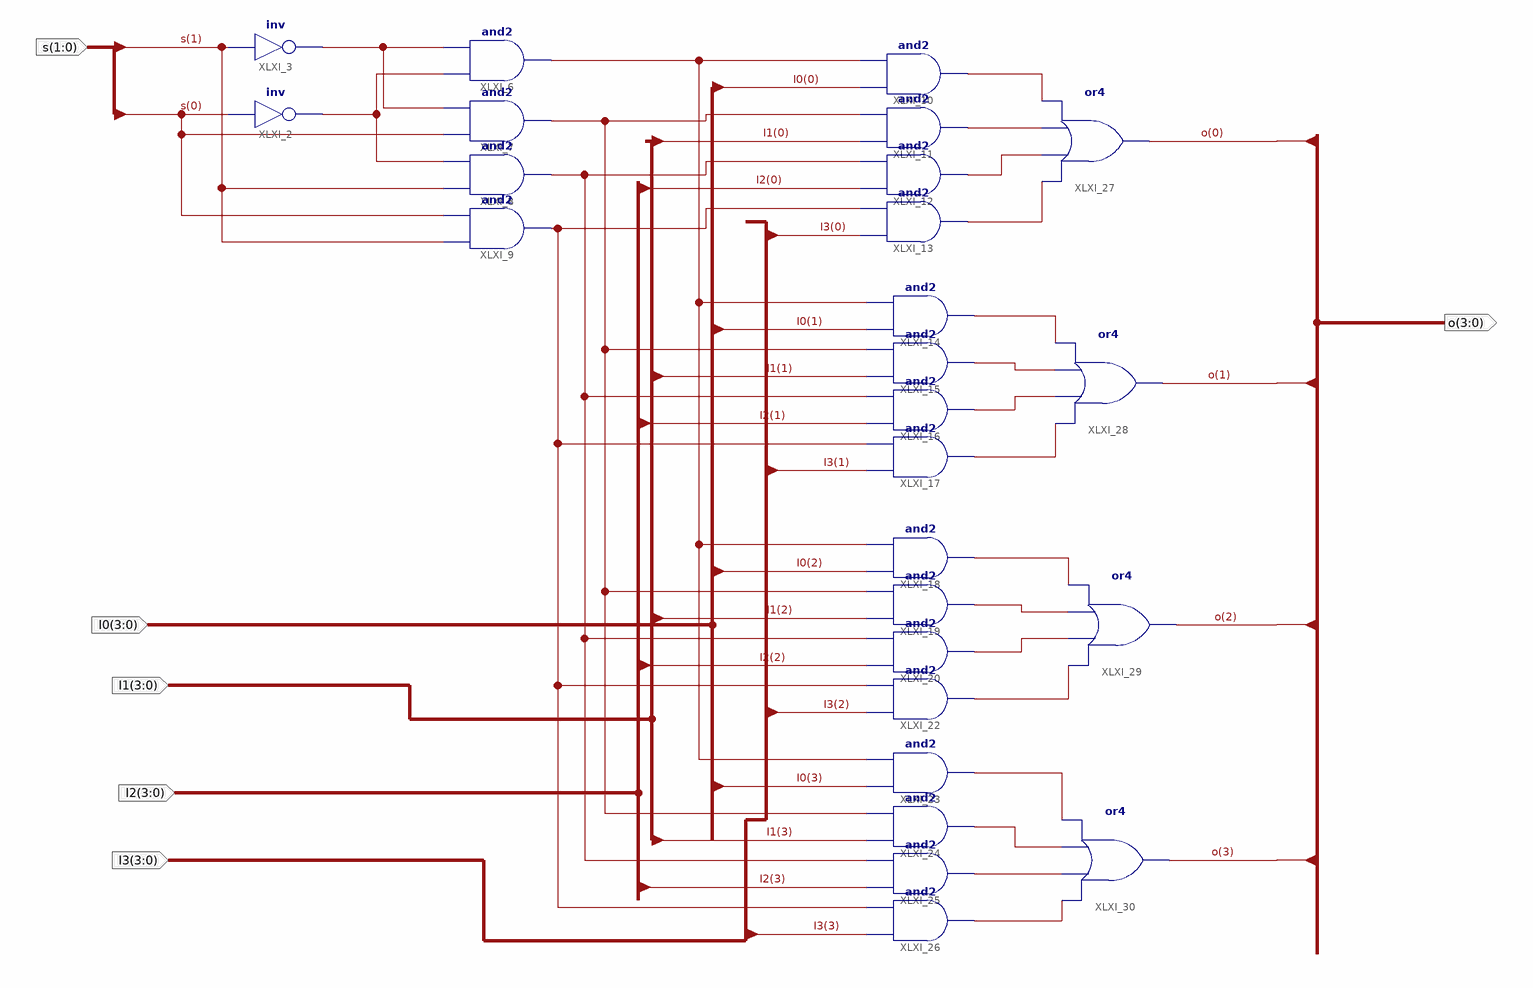
[diagram p0: schematic sheet 1]
// Xilinx ISE schematic Mux4to14b.sch (kintex7) as structural Verilog: 26 symbols, 6 ports
module Mux4to14b (
  input  [1:0] s,
  input  [3:0] I0,
  input  [3:0] I1,
  input  [3:0] I2,
  input  [3:0] I3,
  output [3:0] o
);

  wire XLXN_8, XLXN_9, XLXN_16, XLXN_20, XLXN_24, XLXN_28, XLXN_57, XLXN_58, XLXN_59, XLXN_60, XLXN_61,
       XLXN_62, XLXN_63, XLXN_64, XLXN_65, XLXN_66, XLXN_67, XLXN_68, XLXN_70, XLXN_71, XLXN_72, XLXN_73;

  not XLXI_2 (XLXN_9, s[0]);
  not XLXI_3 (XLXN_8, s[1]);
  and XLXI_6 (XLXN_16, XLXN_9, XLXN_8);
  and XLXI_7 (XLXN_20, s[0], XLXN_8);
  and XLXI_8 (XLXN_24, s[1], XLXN_9);
  and XLXI_9 (XLXN_28, s[1], s[0]);
  and XLXI_10 (XLXN_57, I0[0], XLXN_16);
  and XLXI_11 (XLXN_58, I1[0], XLXN_20);
  and XLXI_12 (XLXN_59, I2[0], XLXN_24);
  and XLXI_13 (XLXN_60, I3[0], XLXN_28);
  and XLXI_14 (XLXN_61, I0[1], XLXN_16);
  and XLXI_15 (XLXN_62, I1[1], XLXN_20);
  and XLXI_16 (XLXN_63, I2[1], XLXN_24);
  and XLXI_17 (XLXN_64, I3[1], XLXN_28);
  and XLXI_18 (XLXN_65, I0[2], XLXN_16);
  and XLXI_19 (XLXN_66, I1[2], XLXN_20);
  and XLXI_20 (XLXN_67, I2[2], XLXN_24);
  and XLXI_22 (XLXN_68, I3[2], XLXN_28);
  and XLXI_23 (XLXN_70, I0[3], XLXN_16);
  and XLXI_24 (XLXN_71, I1[3], XLXN_20);
  and XLXI_25 (XLXN_72, I2[3], XLXN_24);
  and XLXI_26 (XLXN_73, I3[3], XLXN_28);
  or XLXI_27 (o[0], XLXN_60, XLXN_59, XLXN_58, XLXN_57);
  or XLXI_28 (o[1], XLXN_64, XLXN_63, XLXN_62, XLXN_61);
  or XLXI_29 (o[2], XLXN_68, XLXN_67, XLXN_66, XLXN_65);
  or XLXI_30 (o[3], XLXN_73, XLXN_72, XLXN_71, XLXN_70);
endmodule
